# EAGLE schematic ControlBoard (EAGLE 9.0.1)
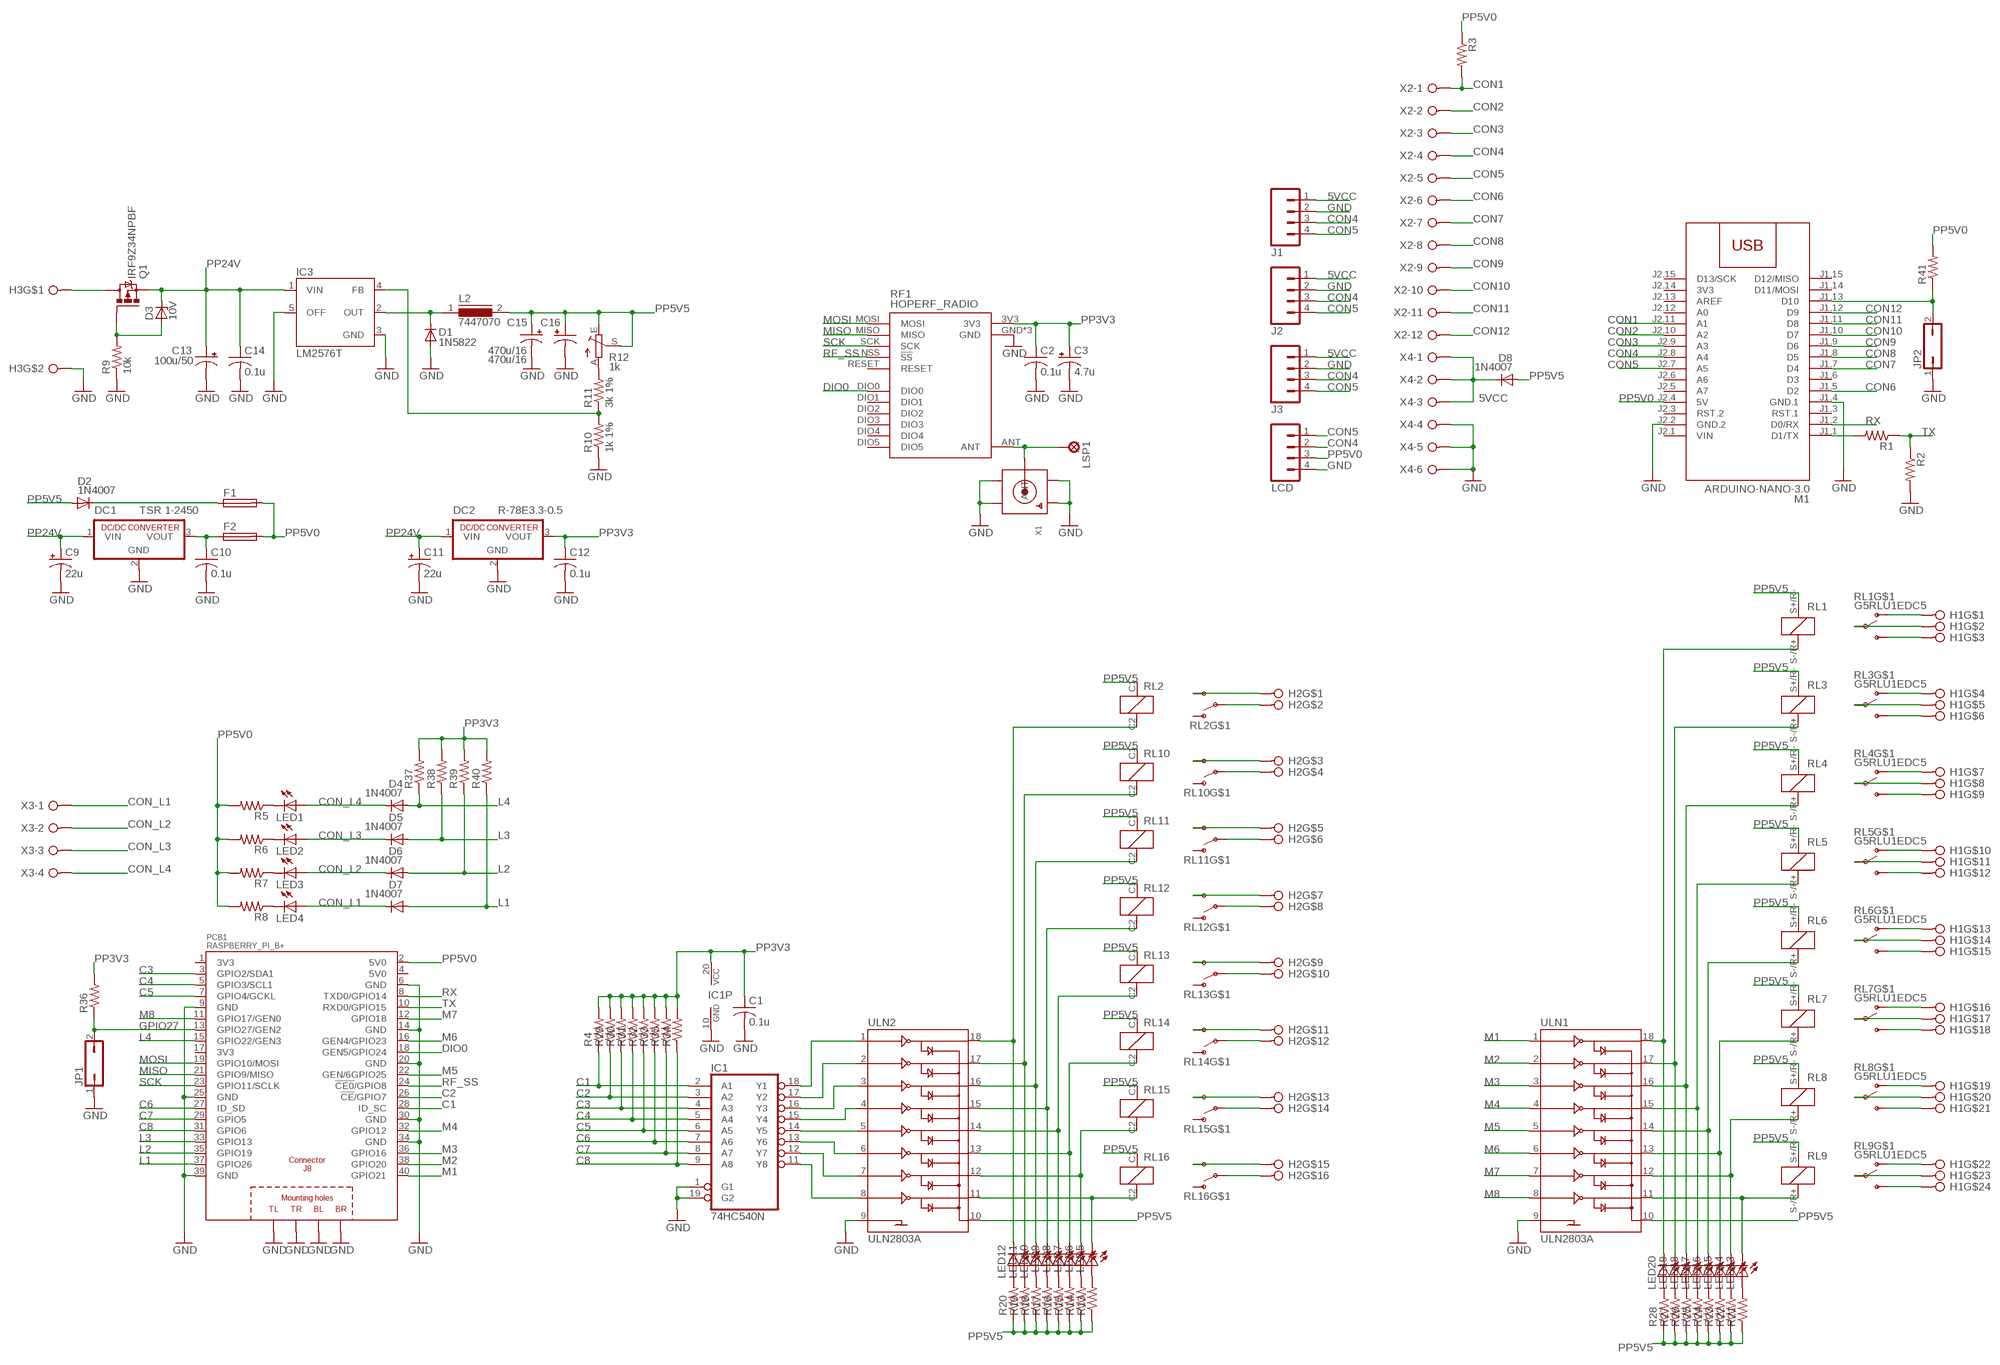
[diagram p0: schematic, sheet 1]

## Parts
C1  0.1u  C-US050-030X075  [C050-030X075]
C2  0.1u  C-US050-030X075  [C050-030X075]
C3  4.7u  CPOL-USE2.5-5  [E2,5-5]
C9  22u  CPOL-USE2.5-6  [E2,5-6]
C10  0.1u  C-US050-030X075  [C050-030X075]
C11  22u  CPOL-USE2.5-6  [E2,5-6]
C12  0.1u  C-US050-030X075  [C050-030X075]
C13  100u/50  CPOL-USE5-10.5  [E5-10,5]
C14  0.1u  C-US050-030X075  [C050-030X075]
C15  470u/16  CPOL-USE5-10.5  [E5-10,5]
C16  470u/16  CPOL-USE5-10.5  [E5-10,5]
D1  1N5822  DIODE-DO201-15  [DO201-15]
D2  1N4007  1N4004  [DO41-10]
D3  10V  ZENER-DIODEDO34-7  [DO34Z7]
D4  1N4007  1N4004  [DO41-10]
D5  1N4007  1N4004  [DO41-10]
D6  1N4007  1N4004  [DO41-10]
D7  1N4007  1N4004  [DO41-10]
D8  1N4007  1N4004  [DO41-10]
DC1  TSR 1-2450  R-78C5.0-1.0  [SIP3]
DC2  R-78E3.3-0.5  R-78C3.3-1.0  [SIP3]
F1  TE5  [TE5]
F2  TE5  [TE5]
H1  24X1(0.300)CONN  [24/7.62CONN]
H2  16X1(0.300)CONN  [16/7.62CONN]
H3  2X1(0.300)CONN  [2/7.62CONN]
IC1  74HC540N  [DIL20]
IC3  LM2576T  [TO220-5]
J1  M04PTH  [1X04]
J2  M04PTH  [1X04]
J3  M04PTH  [1X04]
JP1  JP1Q  [JP1]
JP2  JP1Q  [JP1]
L2  7447070  SFT830D  [SFT830D]
LCD  M04PTH  [1X04]
LED1  LED3MM  [LED3MM]
LED2  LED3MM  [LED3MM]
LED3  LED3MM  [LED3MM]
LED4  LED3MM  [LED3MM]
LED5  LED3MM  [LED3MM]
LED6  LED3MM  [LED3MM]
LED7  LED3MM  [LED3MM]
LED8  LED3MM  [LED3MM]
LED9  LED3MM  [LED3MM]
LED10  LED3MM  [LED3MM]
LED11  LED3MM  [LED3MM]
LED12  LED3MM  [LED3MM]
LED13  LED3MM  [LED3MM]
LED14  LED3MM  [LED3MM]
LED15  LED3MM  [LED3MM]
LED16  LED3MM  [LED3MM]
LED17  LED3MM  [LED3MM]
LED18  LED3MM  [LED3MM]
LED19  LED3MM  [LED3MM]
LED20  LED3MM  [LED3MM]
LSP1  LSP11  [LSP11]
M1  ARDUINO-NANO-3.0  [ARDUINO-NANO-3.0]
PCB1  RASPBERRY_PI_B+  [RASPBERRY_PI_B+]
Q1  IRF9Z34NPBF  IRF9530  [TO220BV]
R1  R-US_0204/7  [0204/7]
R2  R-US_0204/7  [0204/7]
R3  R-US_0204/7  [0204/7]
R4  R-US_0204/7  [0204/7]
R5  R-US_0207/2V  [0207/2V]
R6  R-US_0207/2V  [0207/2V]
R7  R-US_0207/2V  [0207/2V]
R8  R-US_0207/2V  [0207/2V]
R9  10k  R-US_0204/7  [0204/7]
R10  1k 1%  R-US_0207/2V  [0207/2V]
R11  3k 1%  R-US_0207/2V  [0207/2V]
R12  1k  TRIM_EU-RJ9W  [RJ9W]
R13  R-US_0207/2V  [0207/2V]
R14  R-US_0207/2V  [0207/2V]
R15  R-US_0207/2V  [0207/2V]
R16  R-US_0207/2V  [0207/2V]
R17  R-US_0207/2V  [0207/2V]
R18  R-US_0207/2V  [0207/2V]
R19  R-US_0207/2V  [0207/2V]
R20  R-US_0207/2V  [0207/2V]
R21  R-US_0204/7  [0204/7]
R22  R-US_0204/7  [0204/7]
R23  R-US_0204/7  [0204/7]
R24  R-US_0204/7  [0204/7]
R25  R-US_0204/7  [0204/7]
R26  R-US_0204/7  [0204/7]
R27  R-US_0204/7  [0204/7]
R28  R-US_0204/7  [0204/7]
R29  R-US_0204/7  [0204/7]
R30  R-US_0204/7  [0204/7]
R31  R-US_0204/7  [0204/7]
R32  R-US_0204/7  [0204/7]
R33  R-US_0204/7  [0204/7]
R34  R-US_0204/7  [0204/7]
R35  R-US_0204/7  [0204/7]
R36  R-US_0204/7  [0204/7]
R37  R-US_0204/7  [0204/7]
R38  R-US_0204/7  [0204/7]
R39  R-US_0204/7  [0204/7]
R40  R-US_0204/7  [0204/7]
R41  R-US_0204/7  [0204/7]
RF1  HOPERF_RADIO  [RADIO_MODULE]
RL1  G5RLU1EDC5  D_RELAY  [DOUBLE_RELAY]
RL2  OMIH-SS-105LM,300  [OMIH-SS-105LM,300]
RL3  G5RLU1EDC5  D_RELAY  [DOUBLE_RELAY]
RL4  G5RLU1EDC5  D_RELAY  [DOUBLE_RELAY]
RL5  G5RLU1EDC5  D_RELAY  [DOUBLE_RELAY]
RL6  G5RLU1EDC5  D_RELAY  [DOUBLE_RELAY]
RL7  G5RLU1EDC5  D_RELAY  [DOUBLE_RELAY]
RL8  G5RLU1EDC5  D_RELAY  [DOUBLE_RELAY]
RL9  G5RLU1EDC5  D_RELAY  [DOUBLE_RELAY]
RL10  OMIH-SS-105LM,300  [OMIH-SS-105LM,300]
RL11  OMIH-SS-105LM,300  [OMIH-SS-105LM,300]
RL12  OMIH-SS-105LM,300  [OMIH-SS-105LM,300]
RL13  OMIH-SS-105LM,300  [OMIH-SS-105LM,300]
RL14  OMIH-SS-105LM,300  [OMIH-SS-105LM,300]
RL15  OMIH-SS-105LM,300  [OMIH-SS-105LM,300]
RL16  OMIH-SS-105LM,300  [OMIH-SS-105LM,300]
ULN1  ULN2803A  ULN2803DIP  [DIL18]
ULN2  ULN2803A  ULN2803DIP  [DIL18]
X1  SMACONNECTOR  [SMA90_DIP]
X2  W237-12P  [W237-12P]
X3  W237-04P  [W237-4P]
X4  W237-06P  [W237-6P]

## Nets
5VCC: D8.C J1.1 J2.1 J3.1 X4.1 X4.2 X4.3
C1: IC1.2(A1) PCB1.28(ID_SC) R4.1
C2: IC1.3(A2) PCB1.26(!CE!/GPIO7) R29.1
C3: IC1.4(A3) PCB1.3(GPIO2/SDA1) R30.1
C4: IC1.5(A4) PCB1.5(GPIO3/SCL1) R31.1
C5: IC1.6(A5) PCB1.7(GPIO4/GCKL) R32.1
C6: IC1.7(A6) PCB1.27(ID_SD) R33.1
C7: IC1.8(A7) PCB1.29(GPIO5) R35.1
C8: IC1.9(A8) PCB1.31(GPIO6) R34.1
CON1: M1.J2.11(A1) R3.2 X2.1
CON2: M1.J2.10(A2) X2.2
CON3: M1.J2.9(A3) X2.3
CON4: J1.3 J2.3 J3.3 LCD.2 M1.J2.8(A4) X2.4
CON5: J1.4 J2.4 J3.4 LCD.1 M1.J2.7(A5) X2.5
CON6: M1.J1.5(D2) X2.6
CON7: M1.J1.7(D4) X2.7
CON8: M1.J1.8(D5) X2.8
CON9: M1.J1.9(D6) X2.9
CON10: M1.J1.10(D7) X2.10
CON11: M1.J1.11(D8) X2.11
CON12: M1.J1.12(D9) X2.12
CON_L1: D7.C LED4.A X3.1
CON_L2: D6.C LED3.A X3.2
CON_L3: D5.C LED2.A X3.3
CON_L4: D4.C LED1.A X3.4
DIO0: PCB1.18(GEN5/GPIO24) RF1.DIO0
GND: C1.2 C2.2 C3.- C9.- C10.2 C11.- C12.2 C13.- C14.2 C15.- C16.- D1.A DC1.2(GND) DC2.2(GND) H3.P$2 IC1.1(G1) IC1.10(GND) IC1.19(G2) IC3.3(GND) IC3.5(OFF) J1.2 J2.2 J3.2 JP1.1 JP2.1 LCD.4 M1.J1.4(GND.1) M1.J2.2(GND.2) PCB1.6(GND) PCB1.9(GND) PCB1.14(GND) PCB1.20(GND) PCB1.25(GND) PCB1.30(GND) PCB1.34(GND) PCB1.39(GND) PCB1.PE_BL(BL) PCB1.PE_BR(BR) PCB1.PE_TL(TL) PCB1.PE_TR(TR) R2.2 R9.1 R10.1 RF1.GND RF1.GND1(GND) RF1.GND2(GND) ULN1.9 ULN2.9 X1.GND1 X1.GND2 X1.GND3 X1.GND4 X4.4 X4.5 X4.6
GPIO27: JP1.2 PCB1.13(GPIO27/GEN2) R36.1
L1: D7.A PCB1.37(GPIO26) R40.1
L2: D6.A PCB1.35(GPIO19) R39.1
L3: D5.A PCB1.33(GPIO13) R38.1
L4: D4.A PCB1.15(GPIO22/GEN3) R37.1
M1: PCB1.40(GPIO21) ULN1.1
M2: PCB1.38(GPIO20) ULN1.2
M3: PCB1.36(GPIO16) ULN1.3
M4: PCB1.32(GPIO12) ULN1.4
M5: PCB1.22(GEN/6GPIO25) ULN1.5
M6: PCB1.16(GEN4/GPIO23) ULN1.6
M7: PCB1.12(GPIO18) ULN1.7
M8: PCB1.11(GPIO17/GEN0) ULN1.8
MISO: PCB1.21(GPIO9/MISO) RF1.MISO
MOSI: PCB1.19(GPIO10/MOSI) RF1.MOSI
N$1: H1.1 RL1.NC1(NC) RL1.NC2(NC) RL1.NC3(NC)
N$2: H1.3 RL1.NO1(NO) RL1.NO2(NO) RL1.NO3(NO)
N$3: H1.4 RL3.NC1(NC) RL3.NC2(NC) RL3.NC3(NC)
N$4: H1.6 RL3.NO1(NO) RL3.NO2(NO) RL3.NO3(NO)
N$5: H1.7 RL4.NC1(NC) RL4.NC2(NC) RL4.NC3(NC)
N$6: H1.9 RL4.NO1(NO) RL4.NO2(NO) RL4.NO3(NO)
N$7: H1.10 RL5.NC1(NC) RL5.NC2(NC) RL5.NC3(NC)
N$8: H1.12 RL5.NO1(NO) RL5.NO2(NO) RL5.NO3(NO)
N$9: H1.13 RL6.NC1(NC) RL6.NC2(NC) RL6.NC3(NC)
N$10: H1.15 RL6.NO1(NO) RL6.NO2(NO) RL6.NO3(NO)
N$11: H1.16 RL7.NC1(NC) RL7.NC2(NC) RL7.NC3(NC)
N$12: H1.18 RL7.NO1(NO) RL7.NO2(NO) RL7.NO3(NO)
N$13: H1.19 RL8.NC1(NC) RL8.NC2(NC) RL8.NC3(NC)
N$14: H1.21 RL8.NO1(NO) RL8.NO2(NO) RL8.NO3(NO)
N$15: H1.22 RL9.NC1(NC) RL9.NC2(NC) RL9.NC3(NC)
N$16: H1.24 RL9.NO1(NO) RL9.NO2(NO) RL9.NO3(NO)
N$17: H1.2 RL1.COM1(COM) RL1.COM2(COM)
N$18: H1.5 RL3.COM1(COM) RL3.COM2(COM)
N$19: H1.8 RL4.COM1(COM) RL4.COM2(COM)
N$20: H1.11 RL5.COM1(COM) RL5.COM2(COM)
N$21: H1.14 RL6.COM1(COM) RL6.COM2(COM)
N$22: H1.17 RL7.COM1(COM) RL7.COM2(COM)
N$23: H1.20 RL8.COM1(COM) RL8.COM2(COM)
N$24: H1.23 RL9.COM1(COM) RL9.COM2(COM)
N$25: H2.2 RL2.COM
N$26: H2.4 RL10.COM
N$27: H2.6 RL11.COM
N$28: H2.8 RL12.COM
N$29: H2.10 RL13.COM
N$30: H2.12 RL14.COM
N$31: H2.14 RL15.COM
N$32: H2.16 RL16.COM
N$33: H2.1 RL2.NO
N$34: H2.3 RL10.NO
N$35: H2.5 RL11.NO
N$36: H2.7 RL12.NO
N$37: H2.9 RL13.NO
N$38: H2.11 RL14.NO
N$39: H2.13 RL15.NO
N$40: H2.15 RL16.NO
N$41: LED13.K(C) RL9.S-/R+ ULN1.11
N$42: LED14.K(C) RL8.S-/R+ ULN1.12
N$43: LED15.K(C) RL7.S-/R+ ULN1.13
N$44: LED16.K(C) RL6.S-/R+ ULN1.14
N$45: LED17.K(C) RL5.S-/R+ ULN1.15
N$46: LED18.K(C) RL4.S-/R+ ULN1.16
N$47: LED19.K(C) RL3.S-/R+ ULN1.17
N$48: LED20.K(C) RL1.S-/R+ ULN1.18
N$49: LED12.K(C) RL2.C2 ULN2.18
N$50: LED11.K(C) RL10.C2 ULN2.17
N$51: LED10.K(C) RL11.C2 ULN2.16
N$52: LED9.K(C) RL12.C2 ULN2.15
N$53: LED8.K(C) RL13.C2 ULN2.14
N$54: LED7.K(C) RL14.C2 ULN2.13
N$55: LED6.K(C) RL15.C2 ULN2.12
N$56: LED5.K(C) RL16.C2 ULN2.11
N$57: IC1.11(Y8) ULN2.8
N$58: IC1.12(Y7) ULN2.7
N$59: IC1.13(Y6) ULN2.6
N$60: IC1.14(Y5) ULN2.5
N$61: IC1.15(Y4) ULN2.4
N$62: IC1.16(Y3) ULN2.3
N$63: IC1.17(Y2) ULN2.2
N$64: IC1.18(Y1) ULN2.1
N$65: LSP1.MP RF1.ANT X1.ANTENNA(ANT)
N$66: M1.J1.1(D1/TX) R1.2
N$67: LED1.K(C) R5.1
N$68: LED2.K(C) R6.1
N$69: LED3.K(C) R7.1
N$70: D3.A Q1.G R9.2
N$72: IC3.4(FB) R10.2 R11.1
N$73: LED4.K(C) R8.1
N$74: H3.P$1 Q1.D
N$75: D2.C F1.1
N$76: C10.1 DC1.3(VOUT) F2.1
N$77: D1.C IC3.2(OUT) L2.1
N$78: R11.2 R12.A
N$79: LED5.A R13.2
N$80: LED6.A R14.2
N$81: LED7.A R15.2
N$82: LED8.A R16.2
N$83: LED9.A R17.2
N$84: LED10.A R18.2
N$85: LED11.A R19.2
N$86: LED12.A R20.2
N$87: LED13.A R21.2
N$88: LED14.A R22.2
N$89: LED15.A R23.2
N$90: LED16.A R24.2
N$91: LED17.A R25.2
N$92: LED18.A R26.2
N$93: LED19.A R27.2
N$94: LED20.A R28.2
N$103: JP2.2 M1.J1.13(D10) R41.1
PP3V3: C1.1 C2.1 C3.+ C12.1 DC2.3(VOUT) IC1.20(VCC) R4.2 R29.2 R30.2 R31.2 R32.2 R33.2 R34.2 R35.2 R36.2 R37.2 R38.2 R39.2 R40.2 RF1.3V3
PP5V0: F1.2 F2.2 LCD.3 M1.J2.4(5V) PCB1.2(5V0) R3.1 R5.2 R6.2 R7.2 R8.2 R41.2
PP5V5: C15.+ C16.+ D2.A D8.A L2.2 R12.E R12.S R13.1 R14.1 R15.1 R16.1 R17.1 R18.1 R19.1 R20.1 R21.1 R22.1 R23.1 R24.1 R25.1 R26.1 R27.1 R28.1 RL1.S+/R- RL2.C1 RL3.S+/R- RL4.S+/R- RL5.S+/R- RL6.S+/R- RL7.S+/R- RL8.S+/R- RL9.S+/R- RL10.C1 RL11.C1 RL12.C1 RL13.C1 RL14.C1 RL15.C1 RL16.C1 ULN1.10 ULN2.10
PP24V: C9.+ C11.+ C13.+ C14.1 D3.C DC1.1(VIN) DC2.1(VIN) IC3.1(VIN) Q1.S
RF_SS: PCB1.24(!CE0!/GPIO8) RF1.NSS(!SS)
RX: M1.J1.2(D0/RX) PCB1.8(TXD0/GPIO14)
SCK: PCB1.23(GPIO11/SCLK) RF1.SCK
TX: PCB1.10(RXD0/GPIO15) R1.1 R2.1
Unconnected: M1.J1.3(RST.1) M1.J1.6(D3) M1.J1.14(D11/MOSI) M1.J1.15(D12/MISO) M1.J2.3(RST.2) M1.J2.5(A7) M1.J2.6(A6) M1.J2.12(A0) M1.J2.13(AREF) M1.J2.15(D13/SCK) PCB1.1(3V3) PCB1.4(5V0) PCB1.17(3V3) RF1.DIO1 RF1.DIO2 RF1.DIO3 RF1.DIO4 RF1.DIO5 RF1.RESET RL2.NC RL10.NC RL11.NC RL12.NC RL13.NC RL14.NC RL15.NC RL16.NC

## Power pins joined to a net without a drawn wire
3V3: M1.J2.14(3V3)
VIN: M1.J2.1(VIN)

## Library data of the parts
C1 C2 C10 C12 C14 = adafruit:C-US: CAPACITOR, American symbol
C3 C9 C11 C13 C15 C16 = adafruit:CPOL-US: POLARIZED CAPACITOR, American symbol
D1 = A1 VoLTE IoT Design:DIODE-: DIODE
D2 D4-D8 = adafruit:1N4004: DIODE General purpose 1N400x type rectifier (With bigger pads) http://www.ladyada.net/library/pcb/eaglelibrary.html
D3 = diode:ZENER-DIODE: Z-Diode
DC1 DC2 = dc-dc-converter:R-78C*-1.0: INNOLINE DC/DC-Converter 1.0 AMP SIP3 Single Output Source: Data sheet <http://www.mikrocontroller.net/attachment/150645/157764-da-01-en-DC_DC_WANDLER_R_78C5_0_1_0.pdf>
F1 F2 = fuse:TE5: FUSE Wickmann; OC_FARNELL: unknown; OC_NEWARK: unknown
H1 = Customs:24X1(0.300)CONN
H2 = Customs:16X1(0.300)CONN
H3 = Customs:2X1(0.300)CONN
IC1 = 74xx-eu:74*540: Inverting Octal BUFFER and LINE DRIVER, 3-state
IC3 = v-reg-3:LM2576: National Semiconductor <http://www.national.com> 3.0A "Simple Switcher"(c) 52kHz, Vout 1.23-37V (HV: 57V), Vin 40V (HV: 60V), 50µA standby current
J1-J3 LCD = SparkFun-Connectors:M04: Header 4 Standard 4-pin 0.1" header. Use with straight break away headers (SKU : PRT-00116), right angle break away headers (PRT-00553), swiss pins (PRT-00743), machine pins (PRT-00117), and female headers (PRT-00115). Molex polarized connector foot print use with SKU : PRT-08231 with associated crimp pins and housings. 1MM SMD Version SKU: PRT-10208; PROD_ID: CONN-09696
JP1 JP2 = jumper:JP1Q: JUMPER
L2 = inductors:SFT830D: INDUCTOR; SPICEPREFIX: L
LED1-LED20 = adafruit:LED: LED OSRAM: - CHIPLED LG R971, LG N971, LY N971, LG Q971, LY Q971, LO R971, LY R971 LH N974, LH R974 LS Q976, LO Q976, LY Q976 LO Q996 - Hyper CHIPLED LW Q18S LB Q993, LB Q99A, LB R99A - SideLED LS A670, LO A670, LY A670, LG A670, LP A670 LB A673, LV A673, LT A673, LW A673 LH A674 LY A675 LS A676, LA A676, LO A676, LY A676, LW A676 LS A679, LY A679, LG A679 - Hyper Micro SIDELED® LS Y876, LA Y876, LO Y876, LY Y876 LT Y87S - SmartLED LW L88C, LW L88S LB L89C, LB L89S, LG L890 LS L89K, LO L89K, LY L89K LS L896, LA L896, LO L896, LY L896 - TOPLED LS T670, LO T670, LY T670, LG T670, LP T670 LSG T670, LSP T670, LSY T670, LOP T670, LYG T670 LG T671, LOG T671, LSG T671 LB T673, LV T673, LT T673, LW T673 LH T674 LS T676, LA T676, LO T676, LY T676, LB T676, LH T676, LSB T676, LW T676 LB T67C, LV T67C, LT T67C, LS T67K, LO T67K, LY T67K, LW E67C LS E67B, LA E67B, LO E67B, LY E67B, LB E67C, LV E67C, LT E67C LW T67C LS T679, LY T679, LG T679 LS T770, LO T770, LY T770, LG T770, LP T770 LB T773, LV T773, LT T773, LW T773 LH T774 LS E675, LA E675, LY E675, LS T675 LS T776, LA T776, LO T776, LY T776, LB T776 LHGB T686 LT T68C, LB T68C - Hyper Mini TOPLED® LB M676 - Mini TOPLED Santana® LG M470 LS M47K, LO M47K, LY M47K Source: http://www.osram.convergy.de/
LSP1 = solpad:LSP11: SOLDER PAD drill 1.1 mm
M1 = diy-modules:ARDUINO-NANO-3.0: Arduino Nano 3.0 and compatible devices More details available here: https://www.arduino.cc/en/Main/ArduinoBoardNano Click here to find device on ebay.com <http://www.ebay.com/sch/arduino+nano>
PCB1 = RASPBERRY_PI_Bplus:RASPBERRY_PI_B+: Raspberry Pi B+ Based on issue: Thursday, July 10, 2014 - Rev 1.2 LBR by Tim R. 07-2014
Q1 = transistor-power:IRF9530: P-CHANNEL HEXFET POWER-MOS-FET Source: http://www.irf.com/product-info/datasheets/data/irf9530.pdf
R1-R4 R9 R21-R41 = adafruit:R-US_: RESISTOR, American symbol
R5-R8 R10 R11 R13-R20 = A1 VoLTE IoT Design:R-US_: RESISTOR, American symbol
R12 = pot:TRIM_EU-: POTENTIOMETER
RF1 = Customs:HOPERF_RADIO
RL1 RL3-RL9 = Customs:D_RELAY
RL2 RL10-RL16 = Customs:OMIH-SS-105LM,300
ULN1 ULN2 = SparkFun-PowerIC:ULN2803: Darlington Driver ULN2803 Darlington array. 500mA max per channel, 8-channel package. Spark Fun Electronics SKU : COM-00312
X1 = adafruit:SMACONNECTOR: SMA Connector 90° DIP SMA Connector, 50 Ohm (4UConnector: 07259)
X2 = con-wago-508:W237-12P: WAGO SREW CLAMP; OC_FARNELL: unknown; OC_NEWARK: unknown
X3 = con-wago-508:W237-04P: WAGO SREW CLAMP; OC_FARNELL: unknown; OC_NEWARK: unknown
X4 = con-wago-508:W237-06P: WAGO SREW CLAMP; OC_FARNELL: unknown; OC_NEWARK: unknown